# Altium project VS10X3.PrjPCB
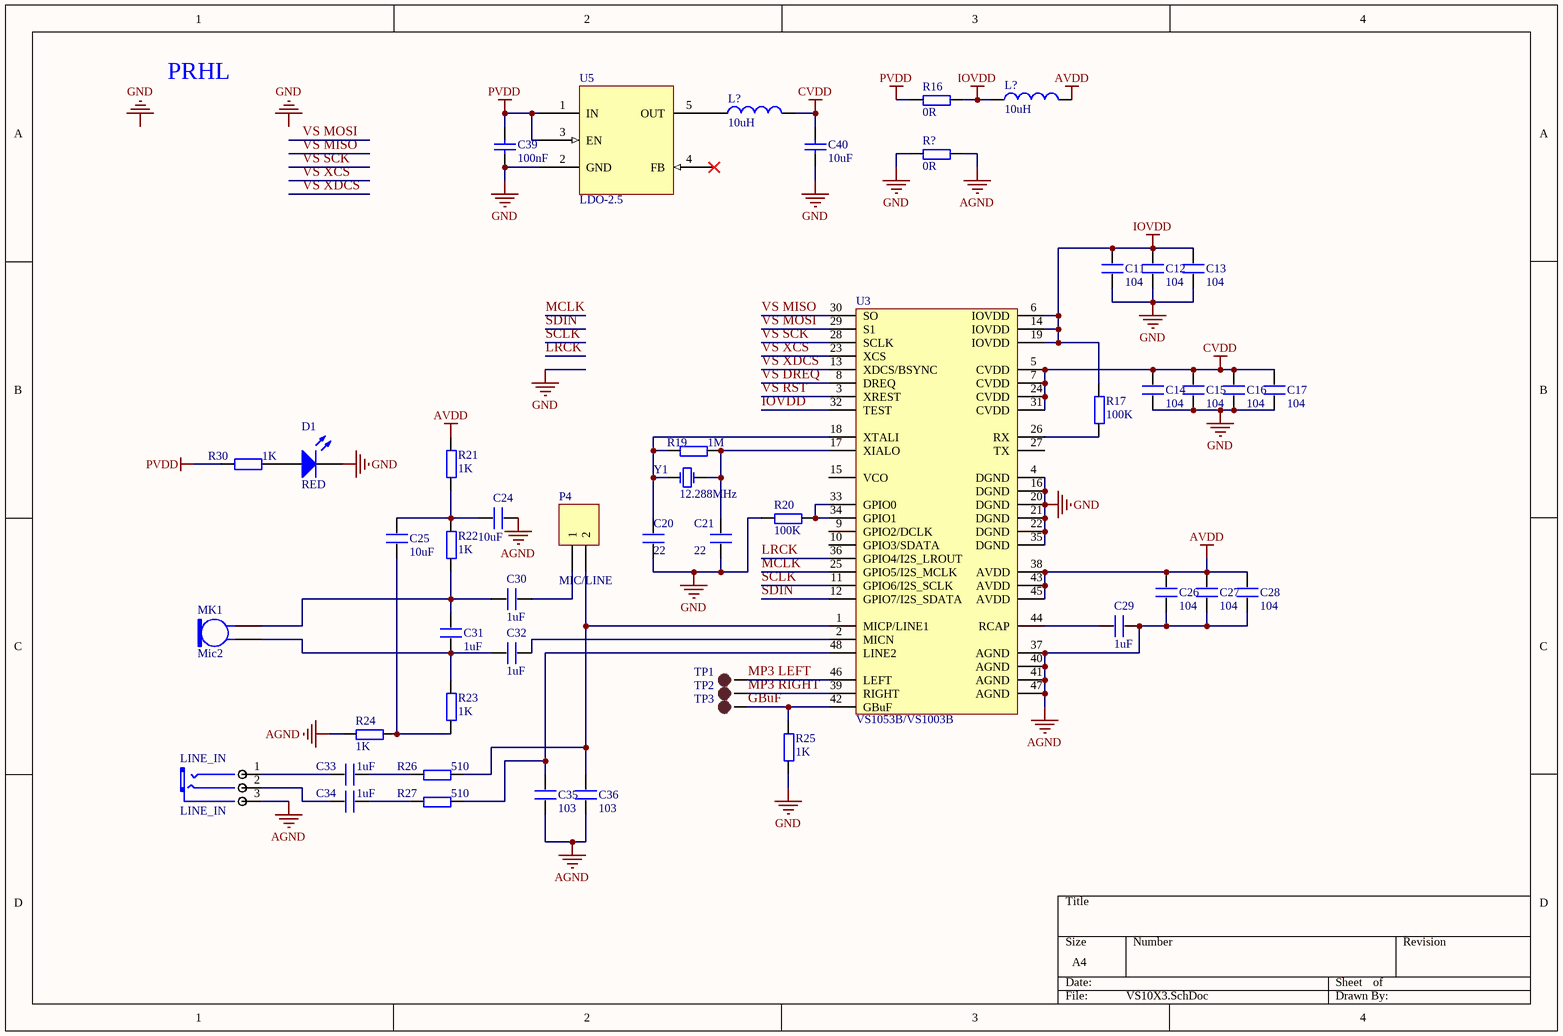
[diagram p0: VS10X3.SchDoc]
1 sheet, 49 parts. Net scope: global (net labels, ports and power ports of the same name join across sheets).
Board file: VS10X3.PcbDoc

## Sheet VS10X3.SchDoc
size A4

### Parts
(Parts that share a designator on the sheet are numbered #1, #2 ... from top to bottom, then left to right.)
C11  104  [0603P]
C12  104  [0603P]
C13  104  [0603P]
C14  104  [0603P]
C15  104  [0603P]
C16  104  [0603P]
C17  104  [0603P]
C20  22  [0603P]
C21  22  [0603P]
C24  10uF  [0603P]
C25  10uF  [0603P]
C26  104  [0603P]
C27  104  [0603P]
C28  104  [0603P]
C29  1uF  [0603P]
C30  1uF  [0603P]
C31  1uF  [0603P]
C32  1uF  [0603P]
C33  1uF  [0603P]
C34  1uF  [0603P]
C35  103  [0603P]
C36  103  [0603P]
C39  100nF  [C0603L]
C40  10uF  [C0805]
D1  RED  [0603pn]
L?#1  10uH  [0805]
L?#2  10uH  [0805]
LINE_IN  LINE_IN  [PHONE_ST]
MK1  Mic2  [Mic-6050]
P4  MIC/LINE  [HDR1X2/2.00MM]
R16  0R  [0603P]
R17  100K  [0603P]
R19  1M  [0603P]
R20  100K  [0603P]
R21  1K  [0603P]
R22  1K  [0603P]
R23  1K  [0603P]
R24  1K  [0603P]
R25  1K  [0603P]
R26  510  [0603P]
R27  510  [0603P]
R30  1K  [0603M]
R?  0R  [0603P]
TP1  TEST POINT  [TP-1.5]  (value not drawn)
TP2  TEST POINT  [TP-1.5]  (value not drawn)
TP3  TEST POINT  [TP-1.5]  (value not drawn)
U3  VS1053B/VS1003B  [mTQFP48]
U5  LDO-2.5  [SOT23-5]
Y1  12.288MHz  [XTAL_US]

### Nets
AGND: C24.1 C26.1 C27.1 C28.1 C29.2 C35.1 C36.1 LINE_IN.3(COM) R24.1 R?.1 U3.37(AGND) U3.40(AGND) U3.41(AGND) U3.47(AGND)
AVDD: C26.2 C27.2 C28.2 L?#1.2 R21.2 U3.38(AVDD) U3.43(AVDD) U3.45(AVDD)
CVDD: C14.2 C15.2 C16.2 C17.2 C40.1 L?#2.2 U3.5(CVDD) U3.7(CVDD) U3.24(CVDD) U3.31(CVDD)
GND: C11.1 C12.1 C13.1 C14.1 C15.1 C16.1 C17.1 C20.1 C21.1 C39.2 C40.2 D1.2(K) R20.1 R25.1 R?.2 U3.4(DGND) U3.16(DGND) U3.20(DGND) U3.21(DGND) U3.22(DGND) U3.35(DGND) U5.2(GND)
IOVDD: C11.2 C12.2 C13.2 L?#1.1 R16.1 R17.2 U3.6(IOVDD) U3.14(IOVDD) U3.19(IOVDD) U3.32(TEST)
PVDD: C39.1 R16.2 R30.2 U5.1(IN) U5.3(EN)
GBuF: R25.2 TP3.1 U3.42(GBuF)
LRCK: U3.36(GPIO4/I2S_LROUT)
MCLK: U3.25(GPIO5/I2S_MCLK)
MP3 LEFT: TP1.1 U3.46(LEFT)
MP3 RIGHT: TP2.1 U3.39(RIGHT)
SCLK: U3.11(GPIO6/I2S_SCLK)
SDIN: U3.12(GPIO7/I2S_SDATA)
VS DREQ: U3.8(DREQ)
VS MISO: U3.30(SO)
VS MOSI: U3.29(S1)
VS RST: U3.3(XREST)
VS SCK: U3.28(SCLK)
VS XCS: U3.23(XCS)
VS XDCS: U3.13(XDCS/BSYNC)
NetC20_2: C20.2 R19.1 U3.18(XTALI) Y1.1(OSC1)
NetC21_2: C21.2 R19.2 U3.17(XIALO) Y1.2(OSC2)
NetC24_2: C24.2 C25.2 R21.1 R22.2
NetC25_1: C25.1 R23.1 R24.2
NetC29_1: C29.1 U3.44(RCAP)
NetC30_1: C30.1 C31.2 MK1.2 R22.1
NetC30_2: C30.2 P4.1
NetC31_1: C31.1 C32.1 MK1.1 R23.2
NetC32_2: C32.2 U3.2(MICN)
NetC33_1: C33.1 LINE_IN.1(CHL)
NetC33_2: C33.2 R26.1
NetC34_1: C34.1 LINE_IN.2(CHR)
NetC34_2: C34.2 R27.1
NetC35_2: C35.2 R27.2 U3.48(LINE2)
NetC36_2: C36.2 P4.2 R26.2 U3.1(MICP/LINE1)
NetD1_1: D1.1(A) R30.1
NetL?#2_1: L?#2.1 U5.5(OUT)
NetR17_1: R17.1 U3.26(RX)
NetR20_2: R20.2 U3.33(GPIO0) U3.34(GPIO1)

Not connected (* = marked no-connect by the designer): U3 9(GPIO2/DCLK) 10(GPIO3/SDATA) 15(VCO) 27(TX); U5 4(FB)*

### Notes on the sheet
- PRHL
- Labels drawn without touching a wire or pin: GND

### Library data of the parts
C11-C17 C20 C21 C24-C36 = C
C39 C40 = Cap: Capacitor; Published: 8-Jun-2000; LatestRevisionDate: 17-Jul-2002; LatestRevisionNote: Re-released for DXP Platform.; PackageReference: RAD-0.3; Publisher: Altium Limited
  C39: Value: 100nF
  C40: Value: 10uF
D1 = LED0: Typical INFRARED GaAs LED; Published: 8-Jun-2000; LatestRevisionDate: 08-Jul-2005; LatestRevisionNote: Mech Layer 1 removed.; PackageReference: LED-0; Publisher: Altium Limited
L?#1 L?#2 = Inductor: Code_IEC: 1005; Published: 8-Jun-2000; LatestRevisionDate: 29-May-2009; LatestRevisionNote: IPC-7351 Footprint Added.; PackageReference: 0402-A; Publisher: Altium Limited; PackageDescription: Chip Inductor; Code_JEITA: 0402; Value: 10uH
LINE_IN = PHONE_M
MK1 = Mic2: Microphone; Published: 24-Mar-1999; LatestRevisionDate: 17-Jul-2002; LatestRevisionNote: Re-released for DXP Platform.; PackageReference: PIN2; Publisher: Altium Limited
P4 = Header 2: Header, 2-Pin; LatestRevisionDate: 17-Jul-2002; LatestRevisionNote: Re-released for DXP Platform.; Publisher: Altium Limited
R16 R17 R19-R27 R? = R
R30 = Res2: Resistor; Published: 8-Jun-2000; LatestRevisionDate: 17-Jul-2002; LatestRevisionNote: Re-released for DXP Platform.; PackageReference: AXIAL-0.4; Publisher: Altium Limited; Value: 1K
TP1-TP3 = TEST-POINT: 测试点
U3 = VS1053
U5 = LDO-SOT23-5: General LDO SOT23-5
Y1 = XTAL_2: Crystal Oscillator; Published: 8-Jun-2000; LatestRevisionDate: 17-Jul-2002; LatestRevisionNote: Re-released for DXP Platform.; Publisher: Altium Limited